# EAGLE schematic Passive Mult (EAGLE 7.7.0)
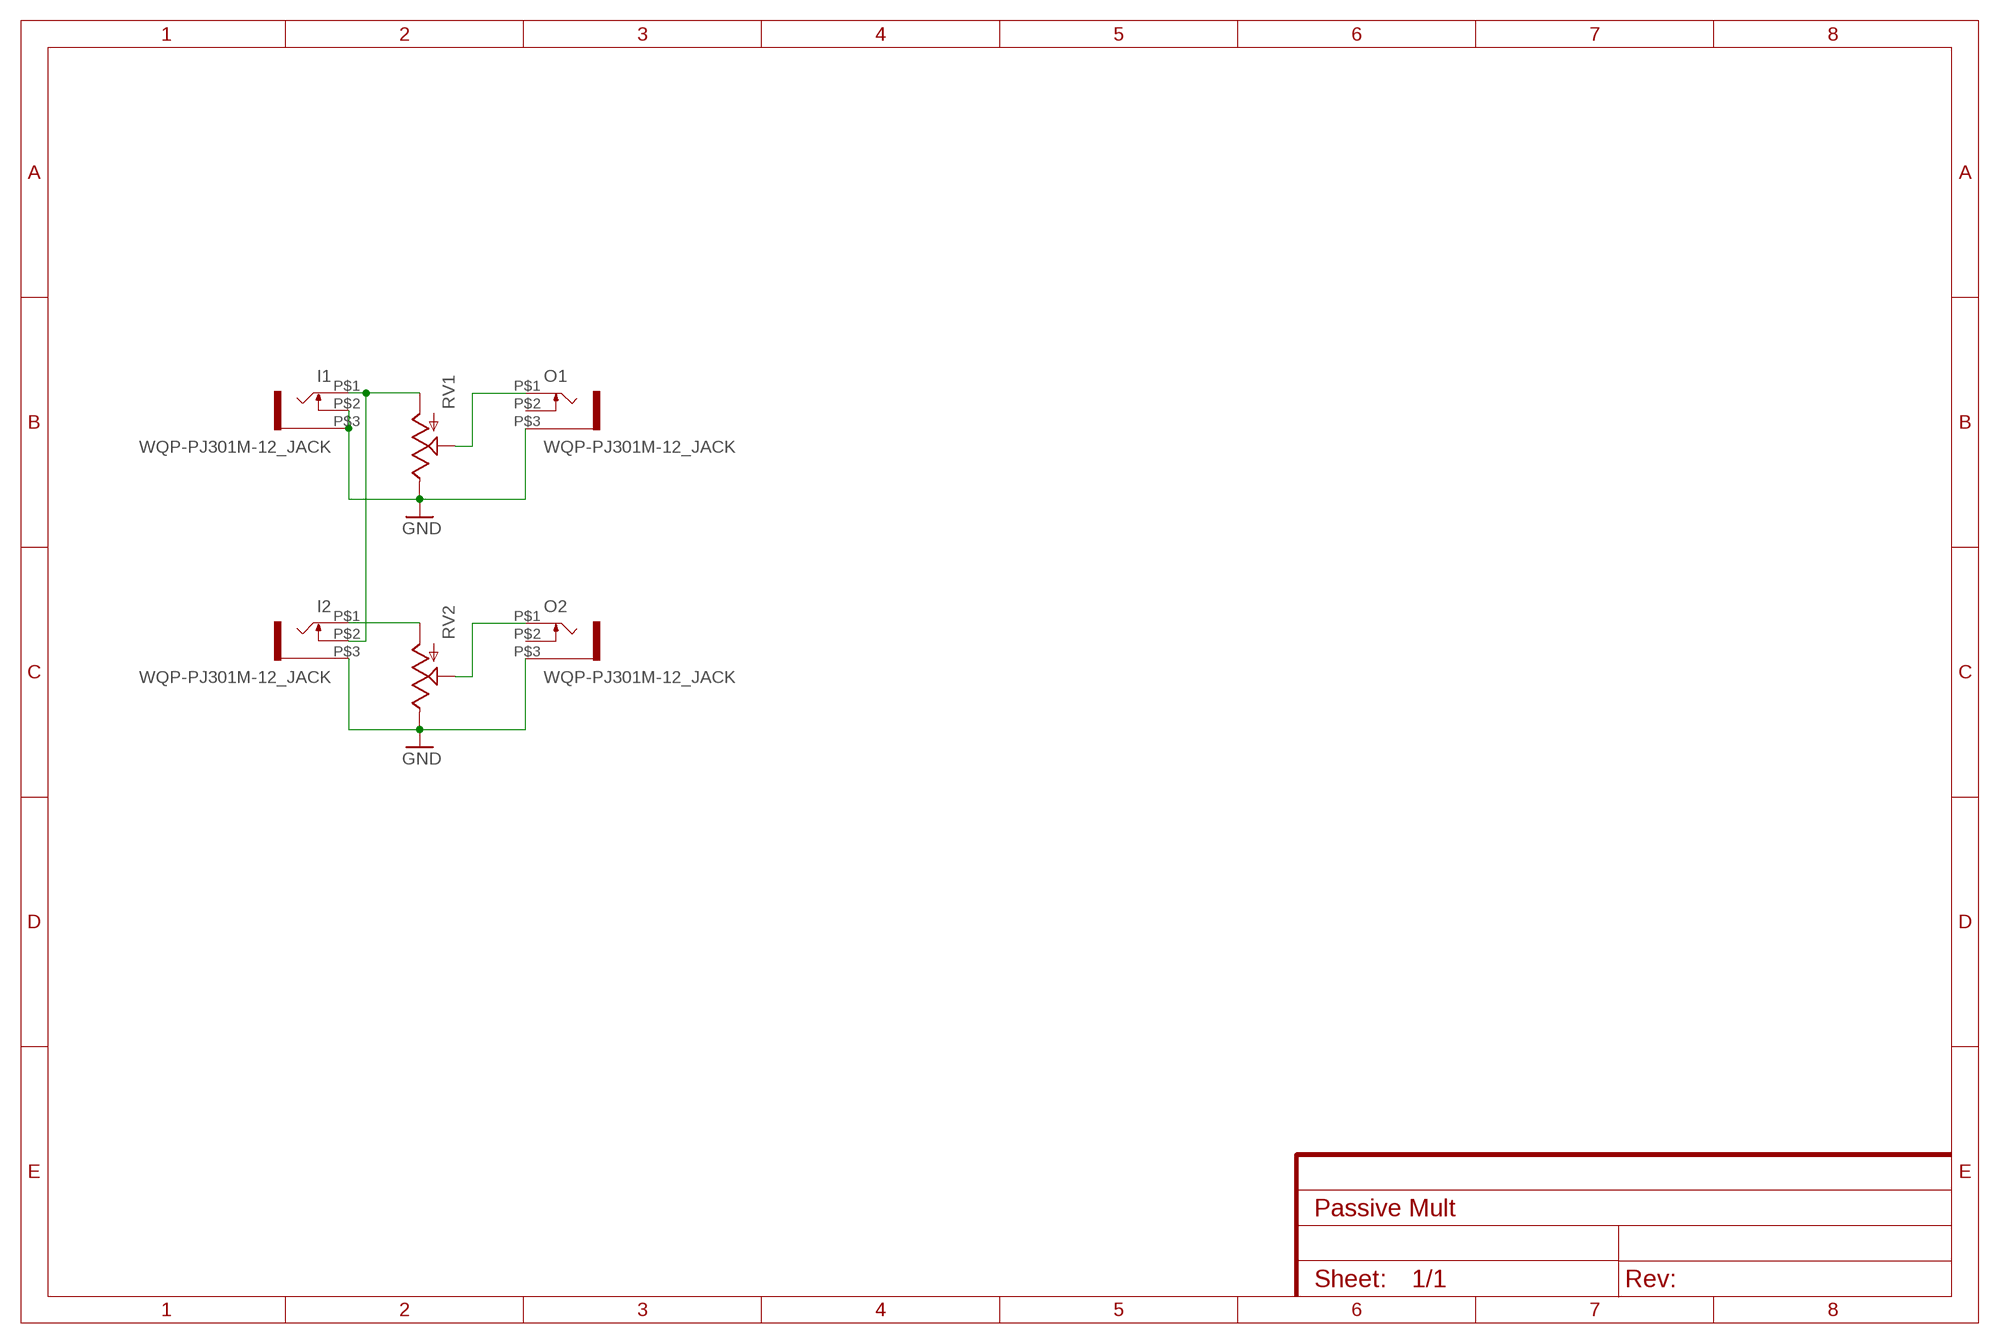
[diagram p0: schematic, sheet 1]

## Parts
I1  WQP-PJ301M-12_JACK  [WQP-PJ301M-12_JACK]
I2  WQP-PJ301M-12_JACK  [WQP-PJ301M-12_JACK]
O1  WQP-PJ301M-12_JACK  [WQP-PJ301M-12_JACK]
O2  WQP-PJ301M-12_JACK  [WQP-PJ301M-12_JACK]
RV1  POT_NO_CLIP  [ALPS_POT_NO_CLIPS]
RV2  POT_NO_CLIP  [ALPS_POT_NO_CLIPS]

## Nets
GND: I1.P$2 I1.P$3 I2.P$3 O1.P$3 O2.P$3 RV1.P$1(E) RV2.P$1(E)
N$2: O1.P$1 RV1.P$2(S)
N$3: I1.P$1 I2.P$2 RV1.P$3(A)
N$4: O2.P$1 RV2.P$2(S)
N$5: I2.P$1 RV2.P$3(A)
Unconnected: O1.P$2 O2.P$2

## Library data of the parts
I1 I2 O1 O2 = thonkiconn:WQP-PJ301M-12_JACK
RV1 RV2 = SparkFun-Electromechanical:POT_NO_CLIP